# Altium schematic sheet mosfets.SchDoc
size 297 x 210 mm
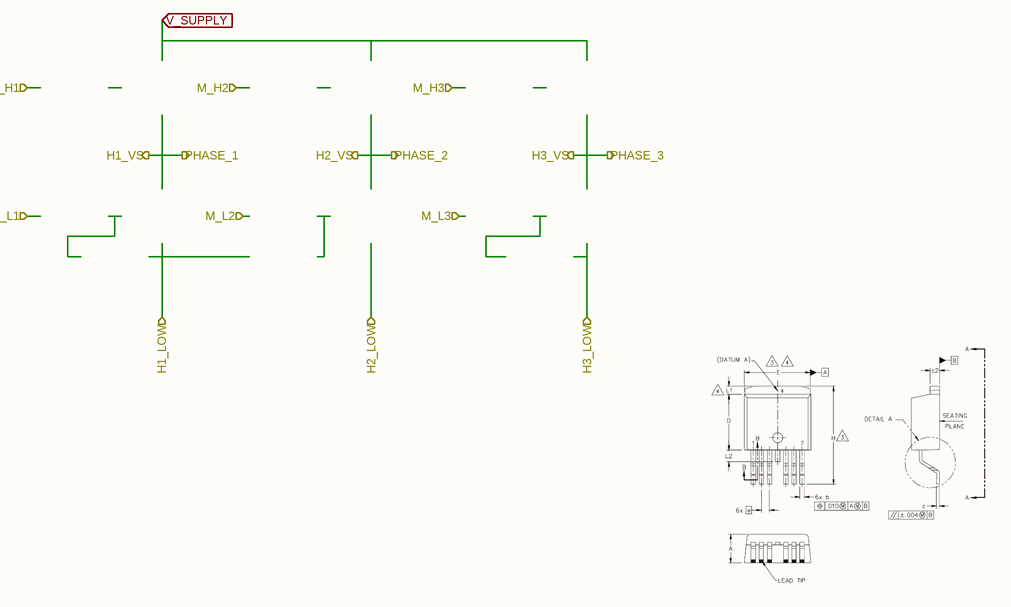
[diagram p0: mosfets.SchDoc]

## Ports
H1_LOW, H1_VS (out), H2_LOW, H2_VS (out), H3_LOW, H3_VS (out), M_H1 (in), M_H2 (in), M_H3 (in), M_L1 (in), M_L2 (in), M_L3 (in), PHASE_1 (out), PHASE_2 (out), PHASE_3 (out), V_SUPPLY (in)

## Nets
H1_VS: port H1_VS, port PHASE_1
H2_VS: port H2_VS, port PHASE_2
H3_VS: port H3_VS, port PHASE_3

## Notes on the sheet
- 1
- 2
- 3
- 4
- 5
- 6
- A
- B
- C
- D
- Title: BLDC Driver 4.11
- File: mosfets.sch
- Sheet: /
- Benjamin Vedder
- KiCad E.D.A.  kicad (5.1.4)-1
- Size: A4
- Date: 21 aug 2015
- Rev: 4.12
- Id: 2/7